# EAGLE schematic MecaArm_Final (EAGLE 9.7.0)
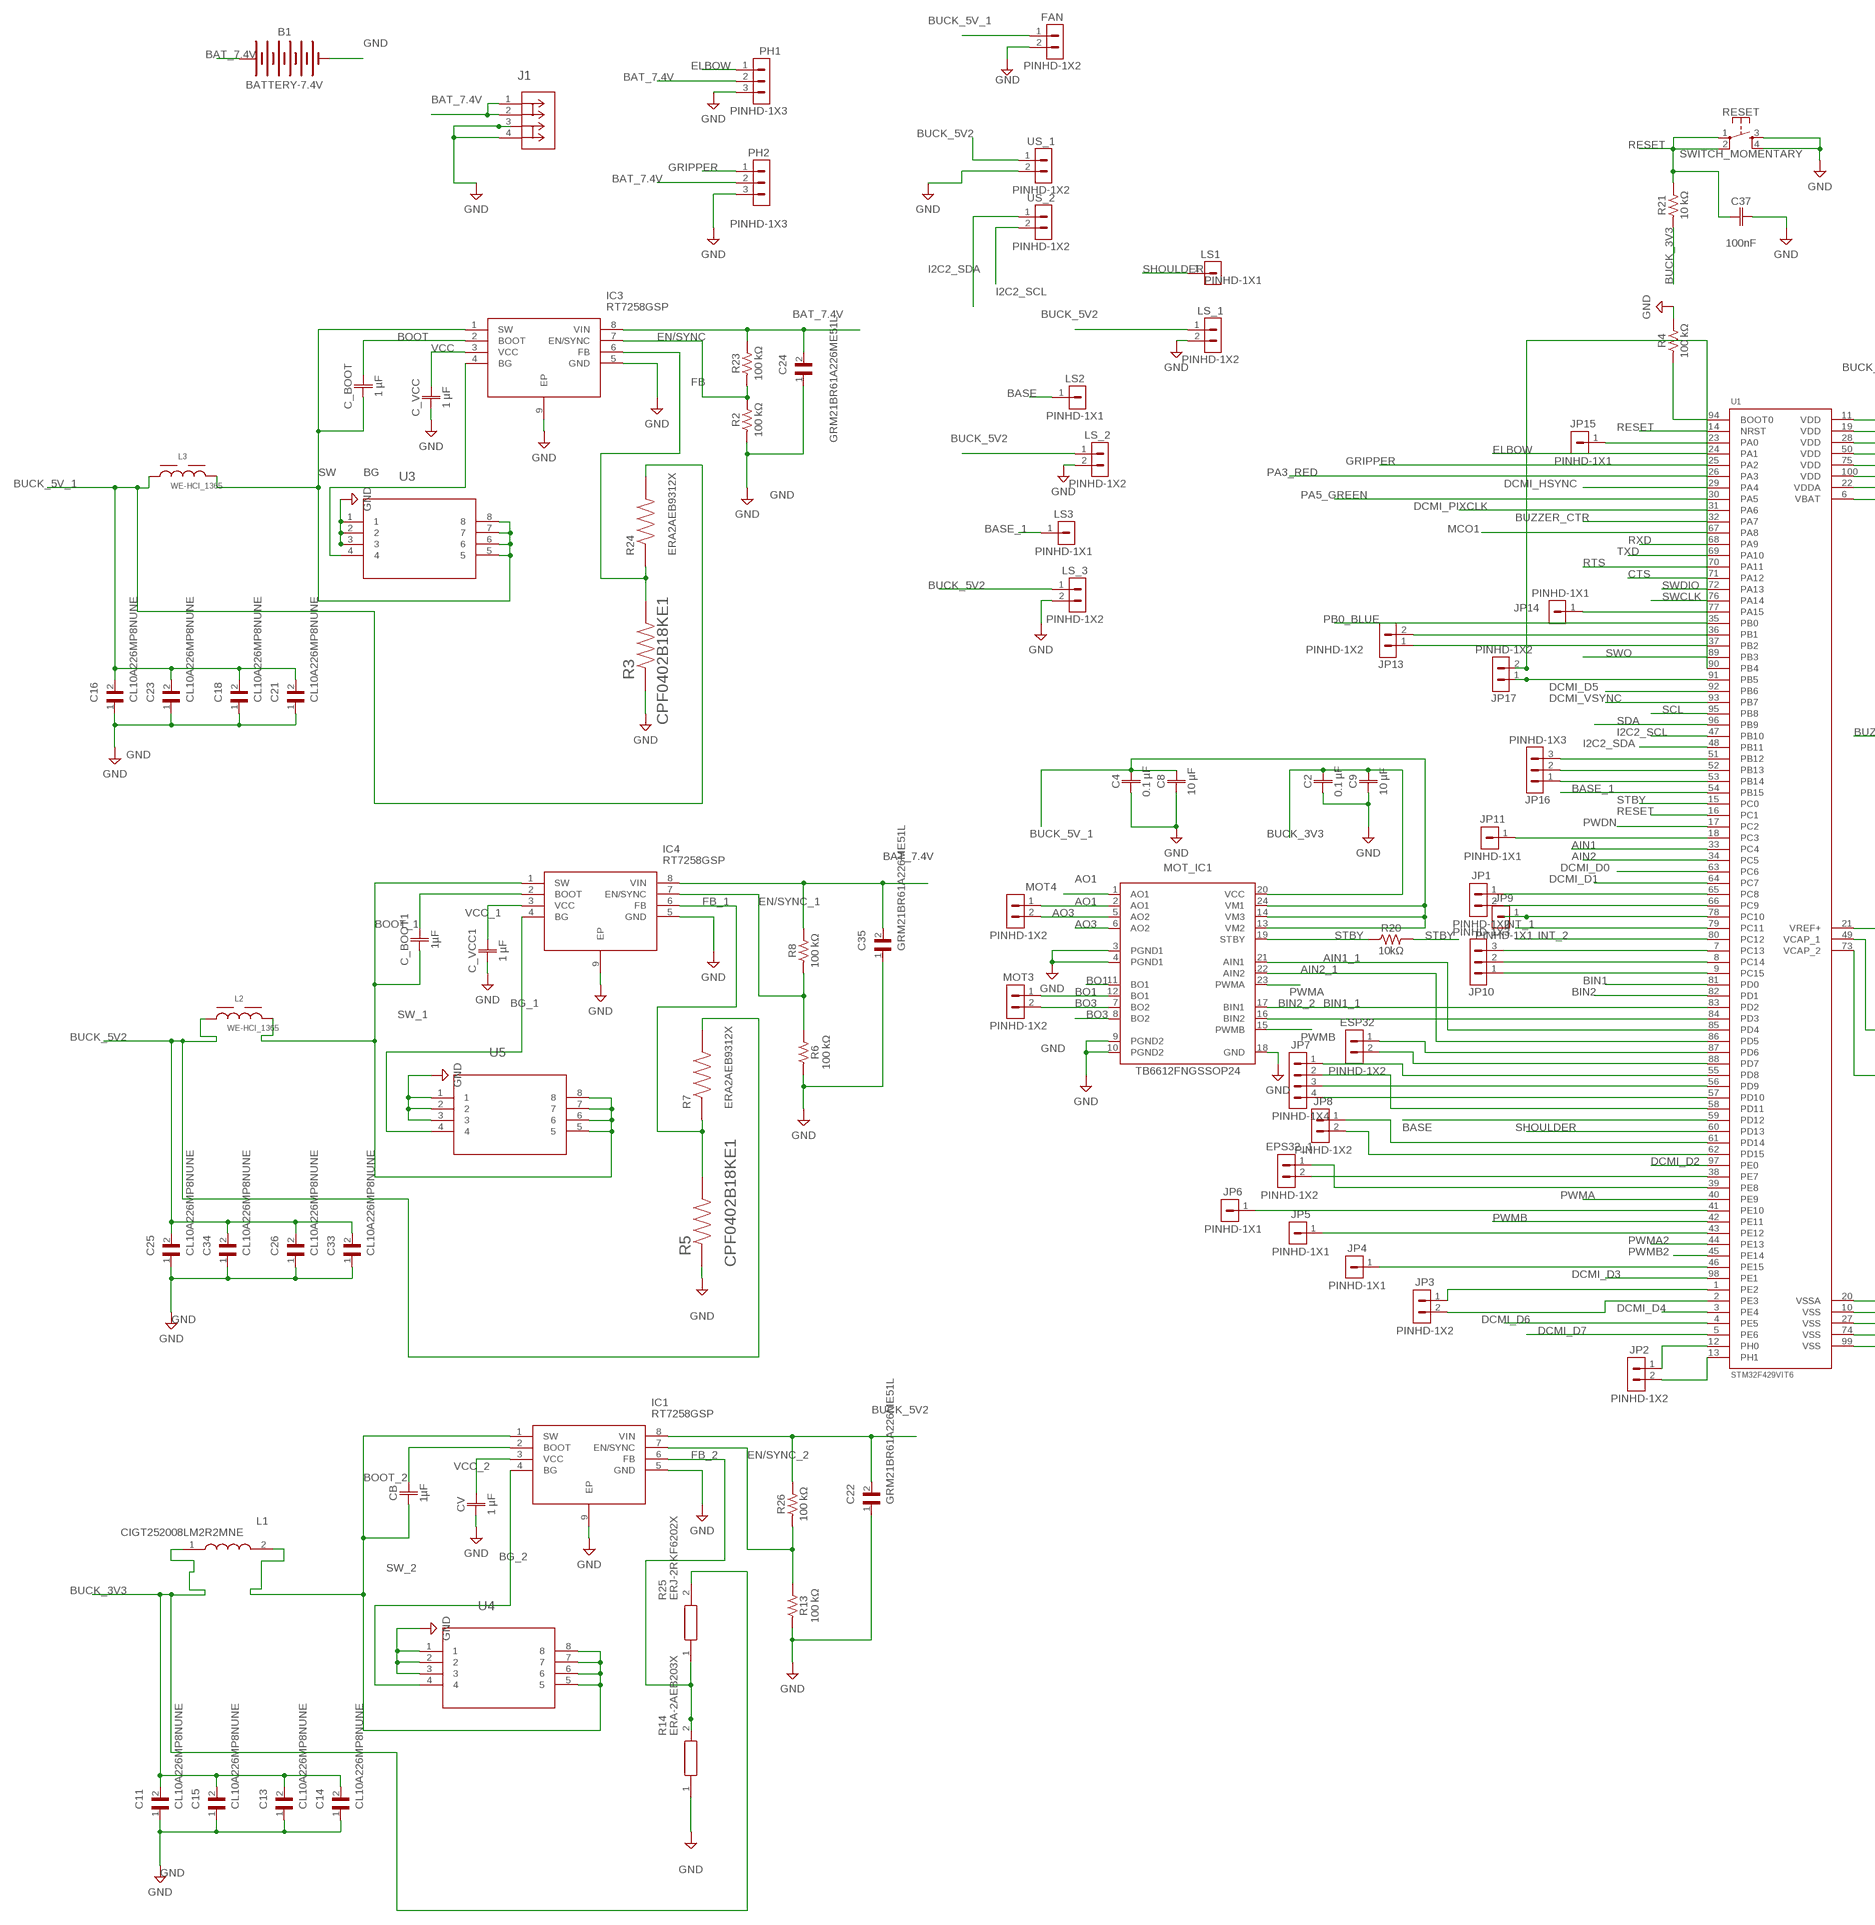
[diagram p0: schematic, sheet 1, part 1 of 2]
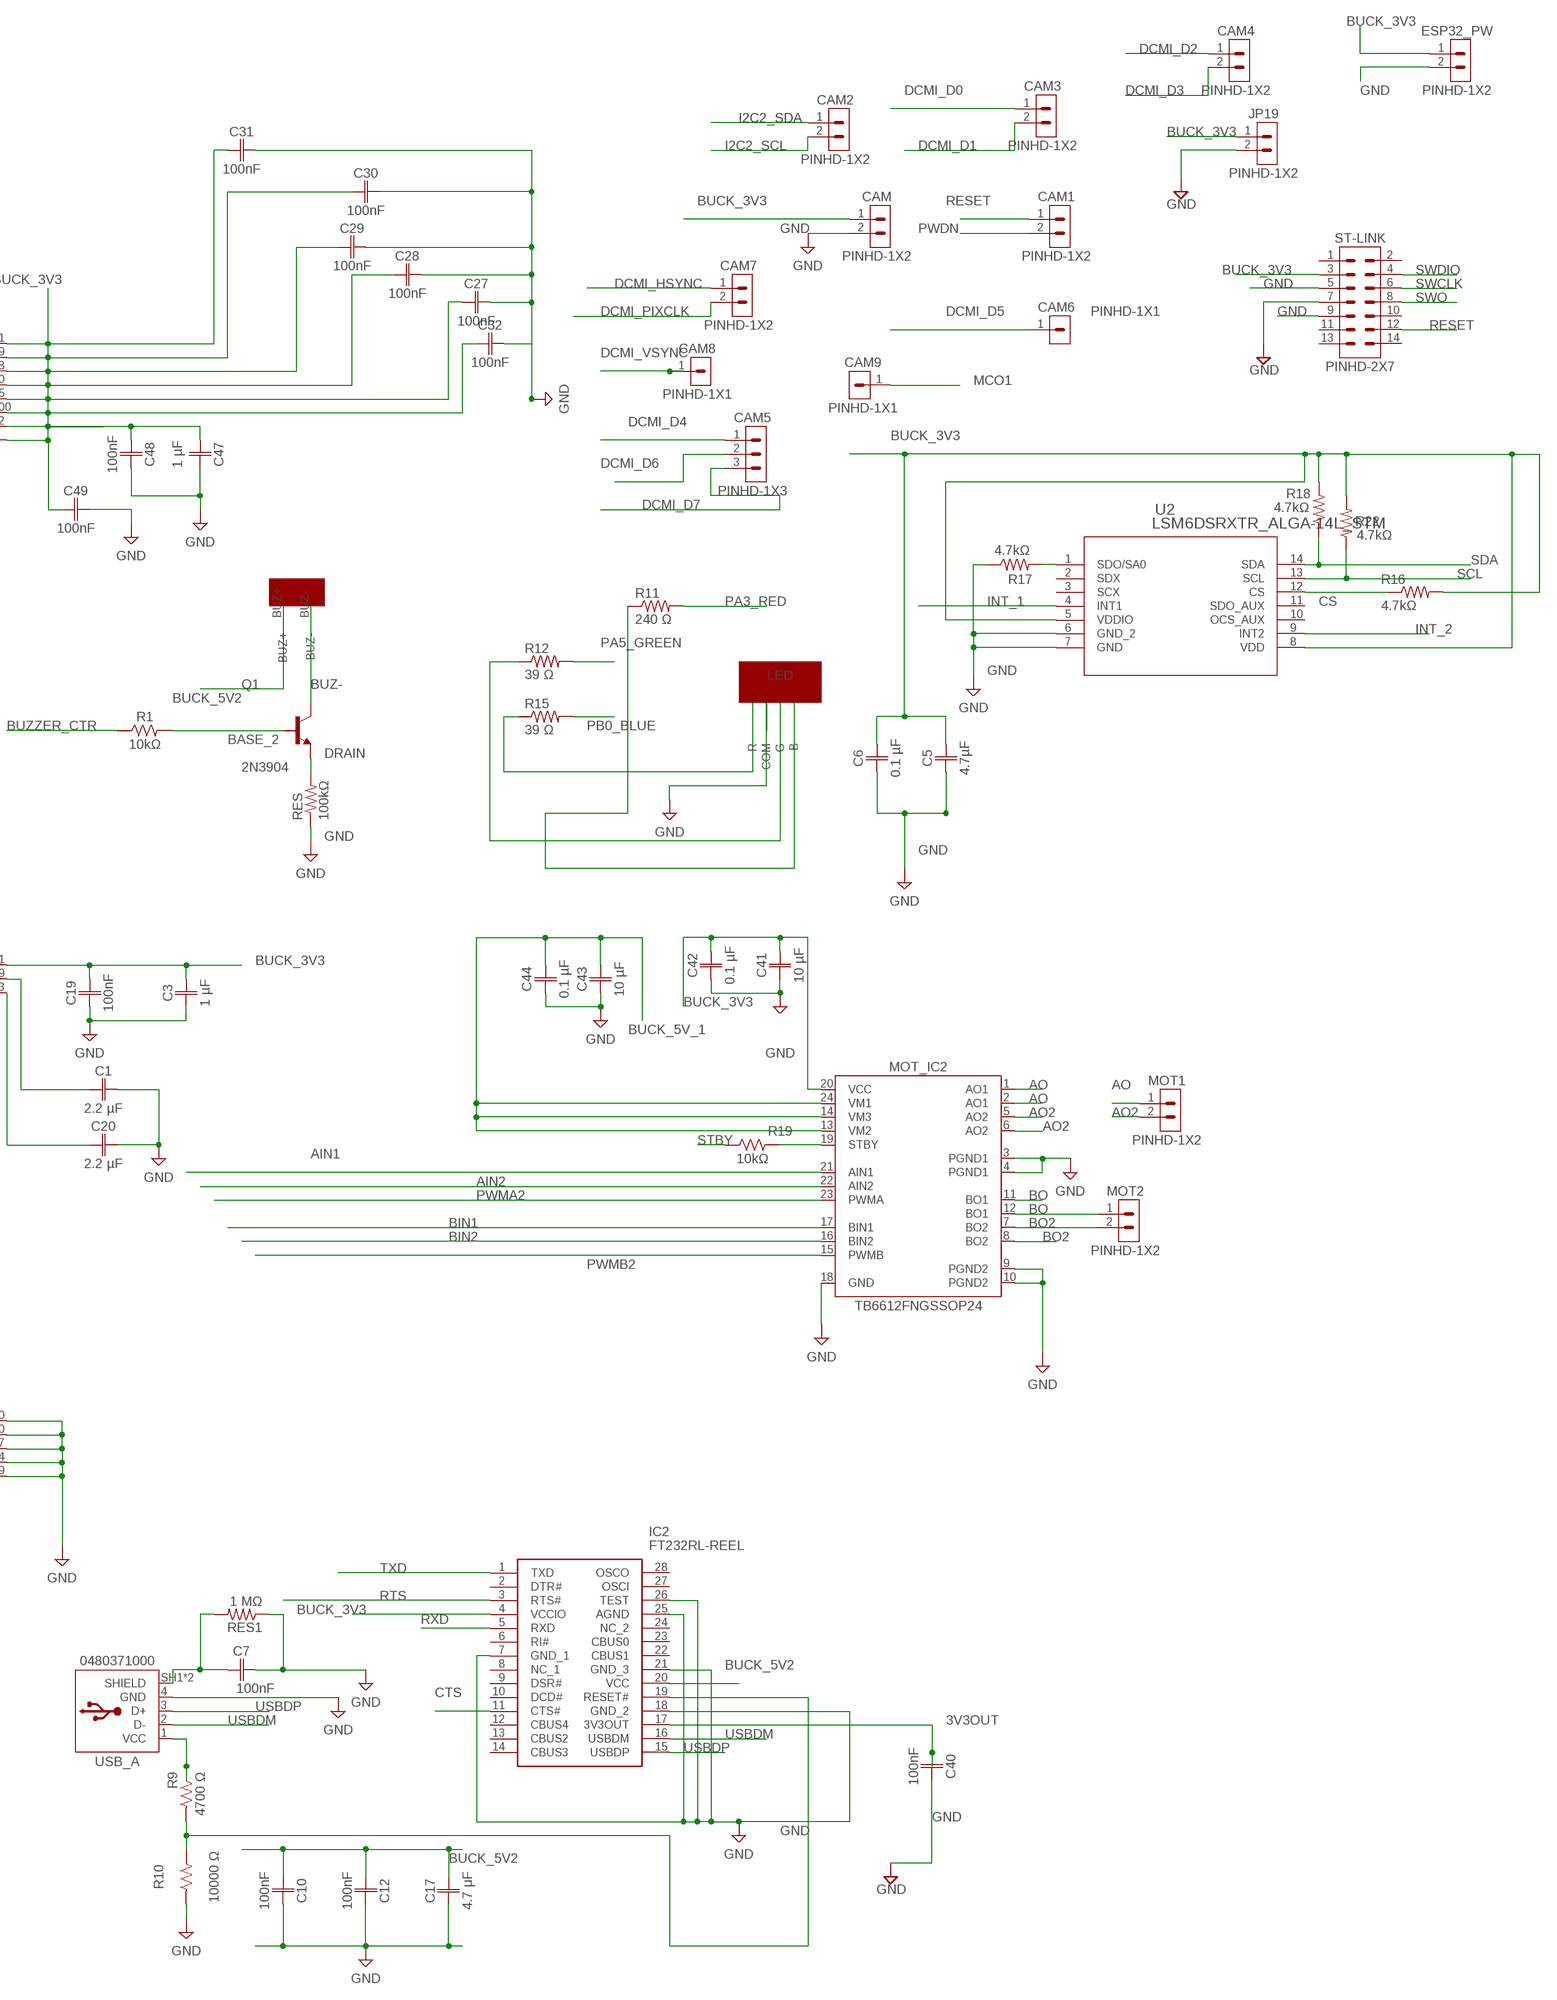
[diagram p1: schematic, sheet 1, part 2 of 2]

## Parts
B1  BATTERY-7.4V  BATTERY-9VGENERIC  [BATTERY-GENERIC]
BUZZER  BUZZER_ACTIVE_12X9P5  [BUZZER-FOOT]
C1  2.2 µF  C_CHIP-0402(1005-METRIC)  [CAPC1005X60]
C2  0.1 µF  C_CHIP-0402(1005-METRIC)  [CAPC1005X60]
C3  1 µF  C_CHIP-0402(1005-METRIC)  [CAPC1005X60]
C4  0.1 µF  C_CHIP-0402(1005-METRIC)  [CAPC1005X60]
C5  4.7µF  C_CHIP-0402(1005-METRIC)  [CAPC1005X60]
C6  0.1 µF  C_CHIP-0402(1005-METRIC)  [CAPC1005X60]
C7  100nF  C_CHIP-0402(1005-METRIC)  [CAPC1005X60]
C8  10 µF  C_CHIP-0402(1005-METRIC)  [CAPC1005X60]
C9  10 µF  C_CHIP-0402(1005-METRIC)  [CAPC1005X60]
C10  100nF  C_CHIP-0402(1005-METRIC)  [CAPC1005X60]
C11  CL10A226MP8NUNE  [CAPC1608X105N]
C12  100nF  C_CHIP-0402(1005-METRIC)  [CAPC1005X60]
C13  CL10A226MP8NUNE  [CAPC1608X105N]
C14  CL10A226MP8NUNE  [CAPC1608X105N]
C15  CL10A226MP8NUNE  [CAPC1608X105N]
C16  CL10A226MP8NUNE  [CAPC1608X105N]
C17  4.7 μF  C_CHIP-0603(1608-METRIC)  [CAPC1608X85]
C18  CL10A226MP8NUNE  [CAPC1608X105N]
C19  100nF  C_CHIP-0402(1005-METRIC)  [CAPC1005X60]
C20  2.2 µF  C_CHIP-0402(1005-METRIC)  [CAPC1005X60]
C21  CL10A226MP8NUNE  [CAPC1608X105N]
C22  GRM21BR61A226ME51L  [CAPC2012X140N]
C23  CL10A226MP8NUNE  [CAPC1608X105N]
C24  GRM21BR61A226ME51L  [CAPC2012X140N]
C25  CL10A226MP8NUNE  [CAPC1608X105N]
C26  CL10A226MP8NUNE  [CAPC1608X105N]
C27  100nF  C_CHIP-0402(1005-METRIC)  [CAPC1005X60]
C28  100nF  C_CHIP-0402(1005-METRIC)  [CAPC1005X60]
C29  100nF  C_CHIP-0402(1005-METRIC)  [CAPC1005X60]
C30  100nF  C_CHIP-0402(1005-METRIC)  [CAPC1005X60]
C31  100nF  C_CHIP-0402(1005-METRIC)  [CAPC1005X60]
C32  100nF  C_CHIP-0402(1005-METRIC)  [CAPC1005X60]
C33  CL10A226MP8NUNE  [CAPC1608X105N]
C34  CL10A226MP8NUNE  [CAPC1608X105N]
C35  GRM21BR61A226ME51L  [CAPC2012X140N]
C37  100nF  C_CHIP-0402(1005-METRIC)  [CAPC1005X60]
C40  100nF  C_CHIP-0402(1005-METRIC)  [CAPC1005X60]
C41  10 µF  C_CHIP-0402(1005-METRIC)  [CAPC1005X60]
C42  0.1 µF  C_CHIP-0402(1005-METRIC)  [CAPC1005X60]
C43  10 µF  C_CHIP-0402(1005-METRIC)  [CAPC1005X60]
C44  0.1 µF  C_CHIP-0402(1005-METRIC)  [CAPC1005X60]
C47  1 µF  C_CHIP-0402(1005-METRIC)  [CAPC1005X60]
C48  100nF  C_CHIP-0402(1005-METRIC)  [CAPC1005X60]
C49  100nF  C_CHIP-0402(1005-METRIC)  [CAPC1005X60]
C_BOOT  1 µF  C_CHIP-0402(1005-METRIC)  [CAPC1005X60]
C_BOOT1  1µF  C_CHIP-0402(1005-METRIC)  [CAPC1005X60]
C_VCC  1 µF  C_CHIP-0402(1005-METRIC)  [CAPC1005X60]
C_VCC1  1 µF  C_CHIP-0402(1005-METRIC)  [CAPC1005X60]
CAM  PINHD-1X2  [1X02]
CAM1  PINHD-1X2  [1X02]
CAM2  PINHD-1X2  [1X02]
CAM3  PINHD-1X2  [1X02]
CAM4  PINHD-1X2  [1X02]
CAM5  PINHD-1X3  [1X03]
CAM6  PINHD-1X1  [1X01]
CAM7  PINHD-1X2  [1X02]
CAM8  PINHD-1X1  [1X01]
CAM9  PINHD-1X1  [1X01]
CB  1µF  C_CHIP-0402(1005-METRIC)  [CAPC1005X60]
CV  1 µF  C_CHIP-0402(1005-METRIC)  [CAPC1005X60]
EPS32_1  PINHD-1X2  [1X02]
ESP32  PINHD-1X2  [1X02]
ESP32_PW  PINHD-1X2  [1X02]
FAN  PINHD-1X2  [1X02]
IC1  RT7258GSP  [SOIC127P600X175-9N]
IC2  FT232RL-REEL  [SOP65P780X200-28N]
IC3  RT7258GSP  [SOIC127P600X175-9N]
IC4  RT7258GSP  [SOIC127P600X175-9N]
J1  1017503CONN_1017491  [CONN_1017491]
JP1  PINHD-1X2  [1X02]
JP2  PINHD-1X2  [1X02]
JP3  PINHD-1X2  [1X02]
JP4  PINHD-1X1  [1X01]
JP5  PINHD-1X1  [1X01]
JP6  PINHD-1X1  [1X01]
JP7  PINHD-1X4  [1X04]
JP8  PINHD-1X2  [1X02]
JP9  PINHD-1X1  [1X01]
JP10  PINHD-1X3  [1X03]
JP11  PINHD-1X1  [1X01]
JP13  PINHD-1X2  [1X02]
JP14  PINHD-1X1  [1X01]
JP15  PINHD-1X1  [1X01]
JP16  PINHD-1X3  [1X03]
JP17  PINHD-1X2  [1X02]
JP19  PINHD-1X2  [1X02]
L1  CIGT252008LM2R2MNE  [INDC2520X80N]
L2  WE-HCI_1365  [WE-HCI_1365]
L3  WE-HCI_1365  [WE-HCI_1365]
LED  LED  [LED-FOOT]
LS1  PINHD-1X1  [1X01]
LS2  PINHD-1X1  [1X01]
LS3  PINHD-1X1  [1X01]
LS_1  PINHD-1X2  [1X02]
LS_2  PINHD-1X2  [1X02]
LS_3  PINHD-1X2  [1X02]
MOT1  PINHD-1X2  [1X02]
MOT2  PINHD-1X2  [1X02]
MOT3  PINHD-1X2  [1X02]
MOT4  PINHD-1X2  [1X02]
MOT_IC1  TB6612FNGSSOP24  [SOP65P760X160-24N]
MOT_IC2  TB6612FNGSSOP24  [SOP65P760X160-24N]
PH1  PINHD-1X3  [1X03]
PH2  PINHD-1X3  [1X03]
Q1  2N3904  [TO92127P495H495-3]
R1  10kΩ  R-US_CHIP-0402(1005-METRIC)  [RESC1005X40]
R2  100 kΩ  R-US_CHIP-0402(1005-METRIC)  [RESC1005X40]
R3  CPF0402B18KE1  [RESC1005X35N]
R4  100 kΩ  R-US_CHIP-0402(1005-METRIC)  [RESC1005X40]
R5  CPF0402B18KE1  [RESC1005X35N]
R6  100 kΩ  R-US_CHIP-0402(1005-METRIC)  [RESC1005X40]
R7  ERA2AEB9312X  [RES_ERA2AEB9312X]
R8  100 kΩ  R-US_CHIP-0402(1005-METRIC)  [RESC1005X40]
R9  4700 Ω  R-US_CHIP-0402(1005-METRIC)  [RESC1005X40]
R10  10000 Ω  R-US_CHIP-0402(1005-METRIC)  [RESC1005X40]
R11  240 Ω  R-US_CHIP-0402(1005-METRIC)  [RESC1005X40]
R12  39 Ω  R-US_CHIP-0402(1005-METRIC)  [RESC1005X40]
R13  100 kΩ  R-US_CHIP-0402(1005-METRIC)  [RESC1005X40]
R14  ERA-2AEB203X  [ERA2AED122X]
R15  39 Ω  R-US_CHIP-0402(1005-METRIC)  [RESC1005X40]
R16  4.7kΩ  R-US_CHIP-0402(1005-METRIC)  [RESC1005X40]
R17  4.7kΩ  R-US_CHIP-0402(1005-METRIC)  [RESC1005X40]
R18  4.7kΩ  R-US_CHIP-0402(1005-METRIC)  [RESC1005X40]
R19  10kΩ  R-US_CHIP-0805(2012-METRIC)  [RESC2012X65]
R20  10kΩ  R-US_CHIP-0805(2012-METRIC)  [RESC2012X65]
R21  10 kΩ  R-US_CHIP-0402(1005-METRIC)  [RESC1005X40]
R22  4.7kΩ  R-US_CHIP-0402(1005-METRIC)  [RESC1005X40]
R23  100 kΩ  R-US_CHIP-0402(1005-METRIC)  [RESC1005X40]
R24  ERA2AEB9312X  [RES_ERA2AEB9312X]
R25  ERJ-2RKF6202X  [ERJ2RKD1004X]
R26  100 kΩ  R-US_CHIP-0402(1005-METRIC)  [RESC1005X40]
RES  100kΩ  R-US_CHIP-0402(1005-METRIC)  [RESC1005X40]
RES1  1 MΩ  R-US_CHIP-0402(1005-METRIC)  [RESC1005X40]
RESET  SWITCH_MOMENTARY  [SWITCH-MOMENTARY-PTH-6.5MM]
ST-LINK  PINHD-2X7  [2X07]
U1  STM32F429VIT6  [QFP50P1600X1600X160-100N]
U2  LSM6DSRXTR_ALGA-14L_STM  [LGA-14L_STM]
U3  SI7114DN-T1-E3MOSFET_4DN-T1-E3_VIS  [MOSFET_4DN-T1-E3_VIS]
U4  SI7114DN-T1-E3MOSFET_4DN-T1-E3_VIS  [MOSFET_4DN-T1-E3_VIS]
U5  SI7114DN-T1-E3MOSFET_4DN-T1-E3_VIS  [MOSFET_4DN-T1-E3_VIS]
US_1  PINHD-1X2  [1X02]
US_2  PINHD-1X2  [1X02]
USB_A  0480371000  [0480371000]

## Nets
3V3OUT: C40.1 IC2.17(3V3OUT)
AIN1: MOT_IC2.21(AIN1) U1.33(PC4)
AIN1_1: MOT_IC1.21(AIN1) U1.85(PD4)
AIN2: MOT_IC2.22(AIN2) U1.34(PC5)
AIN2_1: MOT_IC1.22(AIN2) U1.86(PD5)
AO: MOT1.1 MOT_IC2.1(AO1) MOT_IC2.2(AO1)
AO1: MOT4.1 MOT_IC1.1(AO1) MOT_IC1.2(AO1)
AO2: MOT1.2 MOT_IC2.5(AO2) MOT_IC2.6(AO2)
AO3: MOT4.2 MOT_IC1.5(AO2) MOT_IC1.6(AO2)
BASE: LS2.1 U1.59(PD12)
BASE_1: LS3.1 U1.54(PB15)
BASE_2: Q1.2(B) R1.2
BAT_7.4V: B1.+ C24.2 C35.2 IC3.8(VIN) IC4.8(VIN) J1.1 J1.2 PH1.2 PH2.2 R8.2 R23.2
BG: IC3.4(BG) U3.4
BG_1: IC4.4(BG) U5.4
BG_2: IC1.4(BG) U4.4
BIN1: MOT_IC2.17(BIN1) U1.81(PD0)
BIN1_1: MOT_IC1.17(BIN1) U1.83(PD2)
BIN2: MOT_IC2.16(BIN2) U1.82(PD1)
BIN2_2: MOT_IC1.16(BIN2) U1.84(PD3)
BO: MOT2.1 MOT_IC2.11(BO1) MOT_IC2.12(BO1)
BO1: MOT3.1 MOT_IC1.11(BO1) MOT_IC1.12(BO1)
BO2: MOT2.2 MOT_IC2.7(BO2) MOT_IC2.8(BO2)
BO3: MOT3.2 MOT_IC1.7(BO2) MOT_IC1.8(BO2)
BOOT: C_BOOT.2 IC3.2(BOOT)
BOOT_1: C_BOOT1.2 IC4.2(BOOT)
BOOT_2: CB.2 IC1.2(BOOT)
BUCK_3V3: C2.2 C3.2 C5.2 C6.2 C9.2 C11.2 C13.2 C14.2 C15.2 C19.2 C27.1 C28.1 C29.1 C30.1 C31.1 C32.1 C41.2 C42.2 C49.1 CAM.1 ESP32_PW.1 IC2.4(VCCIO) JP19.1 L1.1 MOT_IC1.20(VCC) MOT_IC2.20(VCC) R16.2 R18.2 R21.1 R22.2 R25.2 ST-LINK.3 U1.6(VBAT) U1.11(VDD) U1.19(VDD) U1.21(VREF+) U1.28(VDD) U1.50(VDD) U1.75(VDD) U1.100(VDD) U2.5(VDDIO) U2.8(VDD)
BUCK_5V2: BUZZER.BUZ+ C10.1 C12.1 C17.2 C22.2 C25.2 C26.2 C33.2 C34.2 IC1.8(VIN) IC2.20(VCC) L2.1 LS_1.1 LS_2.1 LS_3.1 R7.2 R26.2 US_1.1
BUCK_5V_1: C4.2 C8.2 C16.2 C18.2 C21.2 C23.2 C43.2 C44.2 FAN.1 L3.1 MOT_IC1.13(VM2) MOT_IC1.14(VM3) MOT_IC1.24(VM1) MOT_IC2.13(VM2) MOT_IC2.14(VM3) MOT_IC2.24(VM1) R24.2
BUZ-: BUZZER.BUZ- Q1.3(C)
BUZZER_CTR: R1.1 U1.32(PA7)
CS: R16.1 U2.12(CS)
CTS: IC2.11(CTS#) U1.71(PA12)
DCMI_D0: CAM3.1 U1.63(PC6)
DCMI_D1: CAM3.2 U1.64(PC7)
DCMI_D2: CAM4.1 U1.97(PE0)
DCMI_D3: CAM4.2 U1.98(PE1)
DCMI_D4: CAM5.1 U1.3(PE4)
DCMI_D5: CAM6.1 U1.92(PB6)
DCMI_D6: CAM5.2 U1.4(PE5)
DCMI_D7: CAM5.3 U1.5(PE6)
DCMI_HSYNC: CAM7.1 U1.29(PA4)
DCMI_PIXCLK: CAM7.2 U1.31(PA6)
DCMI_VSYNC: CAM8.1 U1.93(PB7)
DRAIN: Q1.1(E) RES.2
ELBOW: PH1.1 U1.24(PA1)
EN/SYNC: IC3.7(EN/SYNC) R2.2 R23.1
EN/SYNC_1: IC4.7(EN/SYNC) R6.2 R8.1
EN/SYNC_2: IC1.7(EN/SYNC) R13.2 R26.1
FB: IC3.6(FB) R3.2 R24.1
FB_1: IC4.6(FB) R5.2 R7.1
FB_2: IC1.6(FB) R14.2 R25.1
GND: B1.- C1.2 C2.1 C3.1 C4.1 C5.1 C6.1 C7.2 C8.1 C9.1 C10.2 C11.1 C12.2 C13.1 C14.1 C15.1 C16.1 C17.1 C18.1 C19.1 C20.2 C21.1 C22.1 C23.1 C24.1 C25.1 C26.1 C27.2 C28.2 C29.2 C30.2 C31.2 C32.2 C33.1 C34.1 C35.1 C37.2 C40.2 C41.1 C42.1 C43.1 C44.1 C47.2 C48.2 C49.2 C_VCC1.1 C_VCC.1 CAM.2 CV.1 ESP32_PW.2 FAN.2 IC1.5(GND) IC1.9(EP) IC2.7(GND_1) IC2.18(GND_2) IC2.21(GND_3) IC2.25(AGND) IC2.26(TEST) IC3.5(GND) IC3.9(EP) IC4.5(GND) IC4.9(EP) J1.3 J1.4 JP19.2 LED.COM LS_1.2 LS_2.2 LS_3.2 MOT_IC1.3(PGND1) MOT_IC1.4(PGND1) MOT_IC1.9(PGND2) MOT_IC1.10(PGND2) MOT_IC1.18(GND) MOT_IC2.3(PGND1) MOT_IC2.4(PGND1) MOT_IC2.9(PGND2) MOT_IC2.10(PGND2) MOT_IC2.18(GND) PH1.3 PH2.3 R2.1 R3.1 R4.2 R5.1 R6.1 R10.1 R13.1 R14.1 R17.1 RES1.1 RES.1 RESET.3 RESET.4 ST-LINK.5 ST-LINK.7 ST-LINK.9 U1.10(VSS) U1.20(VSSA) U1.27(VSS) U1.74(VSS) U1.99(VSS) U2.6(GND_2) U2.7(GND) U3.1 U3.2 U3.3 U4.1 U4.2 U4.3 U5.1 U5.2 U5.3 US_1.2 USB_A.4(GND)
GRIPPER: PH2.1 U1.25(PA2)
I2C2_SCL: CAM2.2 U1.47(PB10) US_2.2
I2C2_SDA: CAM2.1 U1.48(PB11) US_2.1
INT_1: U1.79(PC11) U2.4(INT1)
INT_2: U1.80(PC12) U2.9(INT2)
MCO1: CAM9.1 U1.67(PA8)
N$1: R4.1 U1.94(BOOT0)
N$2: JP2.2 U1.13(PH1)
N$13: C20.1 U1.73(VCAP_2)
N$14: C47.1 C48.1 U1.22(VDDA)
N$15: C1.1 U1.49(VCAP_1)
N$16: JP2.1 U1.12(PH0)
N$18: JP3.1 U1.1(PE2)
N$19: JP3.2 U1.2(PE3)
N$22: JP4.1 U1.46(PE15)
N$27: JP5.1 U1.43(PE12)
N$28: JP6.1 U1.41(PE10)
N$29: EPS32_1.2 U1.38(PE7)
N$30: EPS32_1.1 U1.39(PE8)
N$31: JP8.1 U1.61(PD14)
N$32: JP8.2 U1.62(PD15)
N$33: ESP32.1 U1.87(PD6)
N$34: ESP32.2 U1.88(PD7)
N$35: JP7.1 U1.55(PD8)
N$36: JP7.3 U1.56(PD9)
N$37: JP7.4 U1.57(PD10)
N$38: JP7.2 U1.58(PD11)
N$39: JP1.1 U1.65(PC8)
N$40: JP1.2 U1.66(PC9)
N$41: JP9.1 U1.78(PC10)
N$51: JP10.3 U1.7(PC13)
N$52: JP10.2 U1.8(PC14)
N$53: JP10.1 U1.9(PC15)
N$54: JP11.1 U1.18(PC3)
N$55: JP16.3 U1.51(PB12)
N$56: JP16.2 U1.52(PB13)
N$57: JP16.1 U1.53(PB14)
N$59: JP13.2 U1.36(PB1)
N$60: JP13.1 U1.37(PB2)
N$64: JP17.2 U1.90(PB4)
N$67: R9.2 USB_A.1(VCC)
N$68: JP17.1 U1.91(PB5)
N$71: JP14.1 U1.77(PA15)
N$72: JP15.1 U1.23(PA0)
PA3_RED: R11.2 U1.26(PA3)
PA5_GREEN: R12.2 U1.30(PA5)
PB0_BLUE: R15.2 U1.35(PB0)
PE13: LED.R R15.1
PE15: LED.G R12.1
PE16: LED.B R11.1
PWDN: CAM1.2 U1.17(PC2)
PWMA: MOT_IC1.23(PWMA) U1.40(PE9)
PWMA2: MOT_IC2.23(PWMA) U1.44(PE13)
PWMB: MOT_IC1.15(PWMB) U1.42(PE11)
PWMB2: MOT_IC2.15(PWMB) U1.45(PE14)
RESET: C37.1 CAM1.1 R21.2 RESET.1 RESET.2 ST-LINK.12 U1.14(NRST) U1.16(PC1)
RTS: IC2.3(RTS#) IC2.19(RESET#) R9.1 R10.2 U1.70(PA11)
RXD: IC2.5(RXD) U1.68(PA9)
SCL: R22.1 U1.95(PB8) U2.13(SCL)
SDA: R18.1 U1.96(PB9) U2.14(SDA)
SDO/SA0: R17.2 U2.1(SDO/SA0)
SHIELD: C7.1 RES1.2 USB_A.SH1(SHIELD) USB_A.SH2(SHIELD)
SHOULDER: LS1.1 U1.60(PD13)
STBY: MOT_IC1.19(STBY) MOT_IC2.19(STBY) R19.1 R19.2 R20.1 R20.2 U1.15(PC0)
SW: C_BOOT.1 IC3.1(SW) L3.2 U3.5 U3.6 U3.7 U3.8
SW_1: C_BOOT1.1 IC4.1(SW) L2.2 U5.5 U5.6 U5.7 U5.8
SW_2: CB.1 IC1.1(SW) L1.2 U4.5 U4.6 U4.7 U4.8
SWCLK: ST-LINK.6 U1.76(PA14)
SWDIO: ST-LINK.4 U1.72(PA13)
SWO: ST-LINK.8 U1.89(PB3)
TXD: IC2.1(TXD) U1.69(PA10)
USBDM: IC2.16(USBDM) USB_A.2(D-)
USBDP: IC2.15(USBDP) USB_A.3(D+)
VCC: C_VCC.2 IC3.3(VCC)
VCC_1: C_VCC1.2 IC4.3(VCC)
VCC_2: CV.2 IC1.3(VCC)
Unconnected: IC2.2(DTR#) IC2.6(RI#) IC2.8(NC_1) IC2.9(DSR#) IC2.10(DCD#) IC2.12(CBUS4) IC2.13(CBUS2) IC2.14(CBUS3) IC2.22(CBUS1) IC2.23(CBUS0) IC2.24(NC_2) IC2.27(OSCI) IC2.28(OSCO) ST-LINK.1 ST-LINK.2 ST-LINK.10 ST-LINK.11 ST-LINK.13 ST-LINK.14 U2.2(SDX) U2.3(SCX) U2.10(OCS_AUX) U2.11(SDO_AUX)

## Library data of the parts
B1 = Tinkercad:BATTERY-9V
BUZZER = HW-4:BUZZER_ACTIVE_12X9P5
C1-C10 C12 C19 C20 C27-C32 C37 C40-C44 C47-C49 C_BOOT C_BOOT1 C_VCC C_VCC1 CB CV = Capacitor:C: Capacitor - Generic; CATEGORY: Capacitor; PACKAGE_SIZE: 0402; PACKAGE_TYPE: Surface Mount; SUBCATEGORY: Ceramic Capacitors; TYPE: MLCC
C11 C13-C16 C18 C21 C23 C25 C26 C33 C34 = CL10A226MP8NUNE:CL10A226MP8NUNE; A_MAX: 1.05; A_MIN: 1.05; A_NOM: 1.05; D_MAX: 1.85; D_MIN: 1.35; D_NOM: 1.6; E_MAX: 1.05; E_MIN: 0.55; E_NOM: 0.8; L1_MAX: 0.5; L1_MIN: 0.1; L1_NOM: 0.3; L_MAX: 0.5; L_MIN: 0.1; L_NOM: 0.3; MANUFACTURER: Samsung Electro-Mechanics; STANDARD: IPC 7351B
C17 = Capacitor:C: Capacitor - Generic; CATEGORY: Capacitor; PACKAGE_SIZE: 0603; PACKAGE_TYPE: Surface Mount; SUBCATEGORY: Ceramic Capacitors; TYPE: MLCC
C22 C24 C35 = GRM21BR61A226ME51L:GRM21BR61A226ME51L
CAM CAM1-CAM4 CAM7 EPS32_1 ESP32 ESP32_PW FAN JP1-JP3 JP8 JP13 JP17 JP19 LS_1-LS_3 MOT1-MOT4 US_1 US_2 = Connector:PINHD-1X2: Pin Header; CATEGORY: Connectors; DESCRIPTION: Header-Straight-2 Position; PACKAGE_TYPE: Through Hole; PITCH: 0.100" (2.54mm); SUBCATEGORY: Headers; TYPE: Male Pins
CAM5 JP10 JP16 PH1 PH2 = Connector:PINHD-1X3: Pin Header; CATEGORY: Connectors; DESCRIPTION: Header-Straight-3 Position; PACKAGE_TYPE: Through Hole; PITCH: 0.100" (2.54mm); SUBCATEGORY: Headers; TYPE: Male Pins
CAM6 CAM8 CAM9 JP4-JP6 JP9 JP11 JP14 JP15 LS1-LS3 = Connector:PINHD-1X1: Pin Header; CATEGORY: Connectors; DESCRIPTION: Header-Straight-1 Position; PACKAGE_TYPE: Through Hole; PITCH: 0.100" (2.54mm); SUBCATEGORY: Headers; TYPE: Male Pins
IC1 IC3 IC4 = RT7258GSP:RT7258GSP: IC REG BUCK ADJUSTABLE 8A 8SOP Source: Datasheet <https://www.richtek.com/assets/product_file/RT7258/DS7258-01.pdf>; DESCRIPTION: IC REG BUCK ADJUSTABLE 8A 8SOP; HEIGHT: 1.753mm; MANUFACTURER_NAME: RICHTEK; MANUFACTURER_PART_NUMBER: RT7258GSP
IC2 = FT232RL-REEL:FT232RL-REEL: Check availability <https://pricing.snapeda.com/parts/FT232RLREEL/FTDI%20Chip/view-part?ref=eda>; AVAILABILITY: In Stock; CHECK_PRICES: https://www.snapeda.com/parts/FT232RLREEL/FTDI/view-part/?ref=eda; DESCRIPTION: IC, USB TO UART, SMD, 28SSOP; Bridge Type:USB to UART; Supply Voltage Min:1.8V; Supply Voltage Max:5.25V; Interface Case Style:SSOP; No. of Pins:28Pins; Operating Temperature Min:-40°C; Operating Temperature Max:85°C; Product Range:FT232; Automotive Qualification Standard:-; MSL:MSL 3 - 168 hours; SVHC:No SVHC (15-Jan-2019); Operating Temperature Range:-40°C to +85°C; Supply Voltage Range:1.8V to 5.25V, 3.3V to 5.25V; MF: FTDI Chip; MP: FT232RLREEL; PACKAGE: None; PRICE: None; SNAPEDA_LINK: https://www.snapeda.com/parts/FT232RLREEL/FTDI/view-part/?ref=snap
J1 = 5.08 mm:1017503; COPYRIGHT: Copyright (C) 2025 Ultra Librarian. All rights reserved.; DESCRIPTION: PCB terminal block, nominal current: 32 A, nom. voltage: 400 V, pitch: 5.08 mm, number of positions: 2, connection method: Push-in spring connection, mounting: Wave soldering, conductor/PCB connection direction: 0 °, color: green; MANUFACTURER_NAME: Phoenix Contact; MANUFACTURER_PART_NUMBER: 1017503
JP7 = Connector:PINHD-1X4: Pin Header; CATEGORY: Connectors; DESCRIPTION: Header-Straight-4 Position; PACKAGE_TYPE: Through Hole; PITCH: 0.100" (2.54mm); SUBCATEGORY: Headers; TYPE: Male Pins
L1 = CIGT252008LM2R2MNE:CIGT252008LM2R2MNE: Fixed Inductors CIGT,Thin Film,1008,2.2uH,0.8?,7 embossed,-20 20% Source: Datasheet <https://static6.arrow.com/aropdfconversion/4b7462333dc1b1a70b21ba5f547949827b48753f/cigt252008lm2r2mne.pdf>; DESCRIPTION: Fixed Inductors CIGT,Thin Film,1008,2.2uH,0.8?,7 embossed,-20 20%; HEIGHT: 0.8mm; MANUFACTURER_NAME: SAMSUNG; MANUFACTURER_PART_NUMBER: CIGT252008LM2R2MNE; MOUSER_PART_NUMBER: 187-CIGT252008LM2R2M; MOUSER_PRICE-STOCK: https://www.mouser.co.uk/ProductDetail/Samsung-Electro-Mechanics/CIGT252008LM2R2MNE?qs=xZ%2FP%252Ba9zWqY4uqghLyIqNg%3D%3D
L2 L3 = WE-HCI_1365:WE-HCI_1365
LED = HW-4:LED
MOT_IC1 MOT_IC2 = IC_Power-Management:TB6612FNG: Driver IC for Dual DC motor Reference Datasheet <https://toshiba.semicon-storage.com/info/docget.jsp?did=10660&prodName=TB6612FNG>; CATEGORY: Power Management IC; DATASHEET: https://toshiba.semicon-storage.com/info/TB6612FNG_datasheet_en_20141001.pdf?did=10660&prodName=TB6612FNG; DESCRIPTION: Motor Driver Power MOSFET Parallel 24-SSOP; INPUT_VOLTAGE: 2.7V ~ 5.5V; MANUFACTURER: Toshiba Semiconductor and Storage; MPN: TB6612FNG-C-8-EL; OPERATING_TEMPERATURE: -20°C ~ 85°C; OUTPUT_CURRENT: 1A; OUTPUT_VOLTAGE: NA; PACKAGE_SIZE: 24-LSSOP; PACKAGE_TYPE: SMD; PART_STATUS: ACTIVE; ROHS: COMPLIANT; SERIES: TB6612; SUBCATEGORY: Motor Drivers & Controllers; THERMALLOSS: 0.78 W; TOPOLOGY: NA; TYPE: Half Bridge
Q1 = 2N3904:2N3904; MANUFACTURER: STMicroelectronics; MAXIMUM_PACKAGE_HEIGHT: 4.95 mm; PARTREV: February 2003; STANDARD: IPC 7351B
R1 R2 R4 R6 R8-R10 R13 R21 R23 R26 = Resistor:R-US: Resistor Fixed - ANSI; CATEGORY: Resistors; DESCRIPTION: Chip Resistor 1.05 X 0.54 X 0.40 mm body 0402(1005-METRIC) Package; PACKAGE_SIZE: 0402; PACKAGE_TYPE: Surface Mount
R3 R5 = CPF0402B18KE1:CPF0402B18KE1
R7 R24 = ERA2AEB9312X:ERA2AEB9312X; MANUFACTURER: Panasonic; MAXIMUM_PACKAGE_HEIGHT: 0.35 mm; PARTREV: 3/1/2020; STANDARD: Manufacturer Recommendations
R11 R12 R15-R18 R22 RES RES1 = Tutorial - Fusion 360:R-US: Resistor Fixed - ANSI; CATEGORY: Resistor; SUB-CATEGORY: Fixed
R14 = ERA-2AEB203X:ERA-2AEB203X: Thin Film Resistors - SMD 0402 1/16W 20Kohms Source: Datasheet <http://industrial.panasonic.com/cdbs/www-data/pdf/RDM0000/AOA0000C307.pdf>; DESCRIPTION: Thin Film Resistors - SMD 0402 1/16W 20Kohms; HEIGHT: 0.4mm; MANUFACTURER_NAME: Panasonic; MANUFACTURER_PART_NUMBER: ERA-2AEB203X; MOUSER_PART_NUMBER: 667-ERA-2AEB203X; MOUSER_PRICE-STOCK: https://www.mouser.co.uk/ProductDetail/Panasonic/ERA-2AEB203X?qs=YFwoyZoVY0hdOK9RySFS9g%3D%3D
R19 R20 = Resistor:R-US: Resistor Fixed - ANSI; CATEGORY: Resistors; DESCRIPTION: Chip Resistor 2.00 X 1.25 X 0.65 mm body 0805(2012-METRIC) Package; PACKAGE_SIZE: 0805; PACKAGE_TYPE: Surface Mount
R25 = ERJ-2RKF6202X:ERJ-2RKF6202X: Precision Thick Film Chip Resistor, 0402, 0.063W Source: Datasheet <https://industrial.panasonic.com/cdbs/www-data/pdf/RDA0000/AOA0000C86.pdf>; DESCRIPTION: Precision Thick Film Chip Resistor, 0402, 0.063W; HEIGHT: 0.4mm; MANUFACTURER_NAME: Panasonic; MANUFACTURER_PART_NUMBER: ERJ-2RKF6202X; MOUSER_PART_NUMBER: 667-ERJ-2RKF6202X; MOUSER_PRICE-STOCK: https://www.mouser.co.uk/ProductDetail/Panasonic/ERJ-2RKF6202X?qs=YMBIwoNQYdXDC1TK9PRcsg%3D%3D
RESET = Tinkercad:SWITCH_MOMENTARY
ST-LINK = Connector:PINHD-2X7: Pin Header; CATEGORY: Connectors; DESCRIPTION: Header-Straight-2x7 Position; PACKAGE_TYPE: Through Hole; PITCH: 0.100" (2.54mm); SUBCATEGORY: Headers; TYPE: Male Pins
U1 = STM32F429VIT6:STM32F429VIT6; MANUFACTURER: ST Microelectronics
U2 = AP63357DV-7_A:LSM6DSRXTR_A; COPYRIGHT: Copyright (C) 2025 Ultra Librarian. All rights reserved.; DATASHEET: https://www.st.com/resource/en/datasheet/lsm6dsrx.pdf; DESCRIPTION: 6-axis IMU (inertial measurement unit) with embedded machine learning core: always-on 3-axis accelerometer and 3-axis gyroscope; MANUFACTURER_NAME: STMicroelectronics; MANUFACTURER_PART_NUMBER: LSM6DSRXTR
U3-U5 = buck_5v_MOSFET:SI7114DN-T1-E3; COPYRIGHT: Copyright (C) 2025 Ultra Librarian. All rights reserved.; DATASHEET: https://www.vishay.com/doc?73039; DESCRIPTION: N-CH 30-V (D-S) FAST SWITCHING MOSFET; MANUFACTURER_NAME: Vishay; MANUFACTURER_PART_NUMBER: SI7114DN-T1-E3
USB_A = Connector_USB:0480371000: USB(2.0) Type-A- PLUG- 4POS- SMD-THT-R/A Reference: Datasheet <https://www.molex.com/pdm_docs/sd/480371000_sd.pdf>; CATEGORY: USB Connector; CONTACTS: 4; CURRENT_RATING: 1.5A; DATASHEET: https://www.molex.com/en-us/products/part-detail-pdf/480371000?display=pdf; DESCRIPTION: USB-A (USB TYPE-A) USB 2.0 Plug Connector 4 Position Surface Mount- Right Angle- Through Hole; GENDER: Plug; MANUFACTURER: Molex; MPN: 0480371000; OPERATING_TEMPERATURE: -20°C ~ 85°C; PACKAGE_SIZE: NA; PACKAGE_TYPE: Surface Mount; PART_STATUS: Active; ROHS: Compliant; SERIES: 48037; SUBCATEGORY: USB TYPE-A; TYPE: Surface Mount-Right Angle-Through Hole; VOLTAGE_RATING: 150VAC